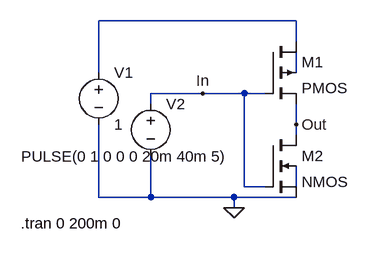
[diagram p0: schematic CMOS Inverter.asc]
CMOS Inverter.asc, the LTspice schematic file:
Version 4
SHEET 1 880 680
WIRE 192 32 -112 32
WIRE 192 64 192 32
WIRE -112 112 -112 32
WIRE 192 112 192 80
WIRE 48 144 -32 144
WIRE 112 144 48 144
WIRE 144 144 112 144
WIRE -32 160 -32 144
WIRE 192 192 192 160
WIRE 192 208 192 192
WIRE 112 288 112 144
WIRE 144 288 112 288
WIRE 192 288 192 256
WIRE -112 304 -112 192
WIRE -32 304 -32 240
WIRE -32 304 -112 304
WIRE 96 304 -32 304
WIRE 192 304 96 304
WIRE 96 320 96 304
FLAG 96 320 0
FLAG 48 144 In
FLAG 192 192 Out
SYMBOL pmos4 144 64 R0
SYMATTR InstName M1
SYMBOL voltage -112 96 R0
WINDOW 123 0 0 Left 0
WINDOW 39 0 0 Left 0
SYMATTR InstName V1
SYMATTR Value 1
SYMBOL voltage -32 144 R0
WINDOW 3 -199 97 Left 2
WINDOW 123 0 0 Left 0
WINDOW 39 0 0 Left 0
SYMATTR InstName V2
SYMATTR Value PULSE(0 1 0 0 0 20m 40m 5)
SYMBOL nmos4 144 208 R0
SYMATTR InstName M2
TEXT -232 344 Left 2 !.tran 0 200m 0

The netlist it stands for:
* CMOS Inverter.asc
M1 N001 In Out N002 PMOS
V1 N001 0 1
V2 In 0 PULSE(0 1 0 0 0 20m 40m 5)
M2 Out In 0 N003 NMOS
.model NMOS NMOS
.model PMOS PMOS
.lib standard.mos
.tran 0 200m 0
.backanno
.end